# EAGLE design snarf-basecase-v00 (EAGLE 5.11)
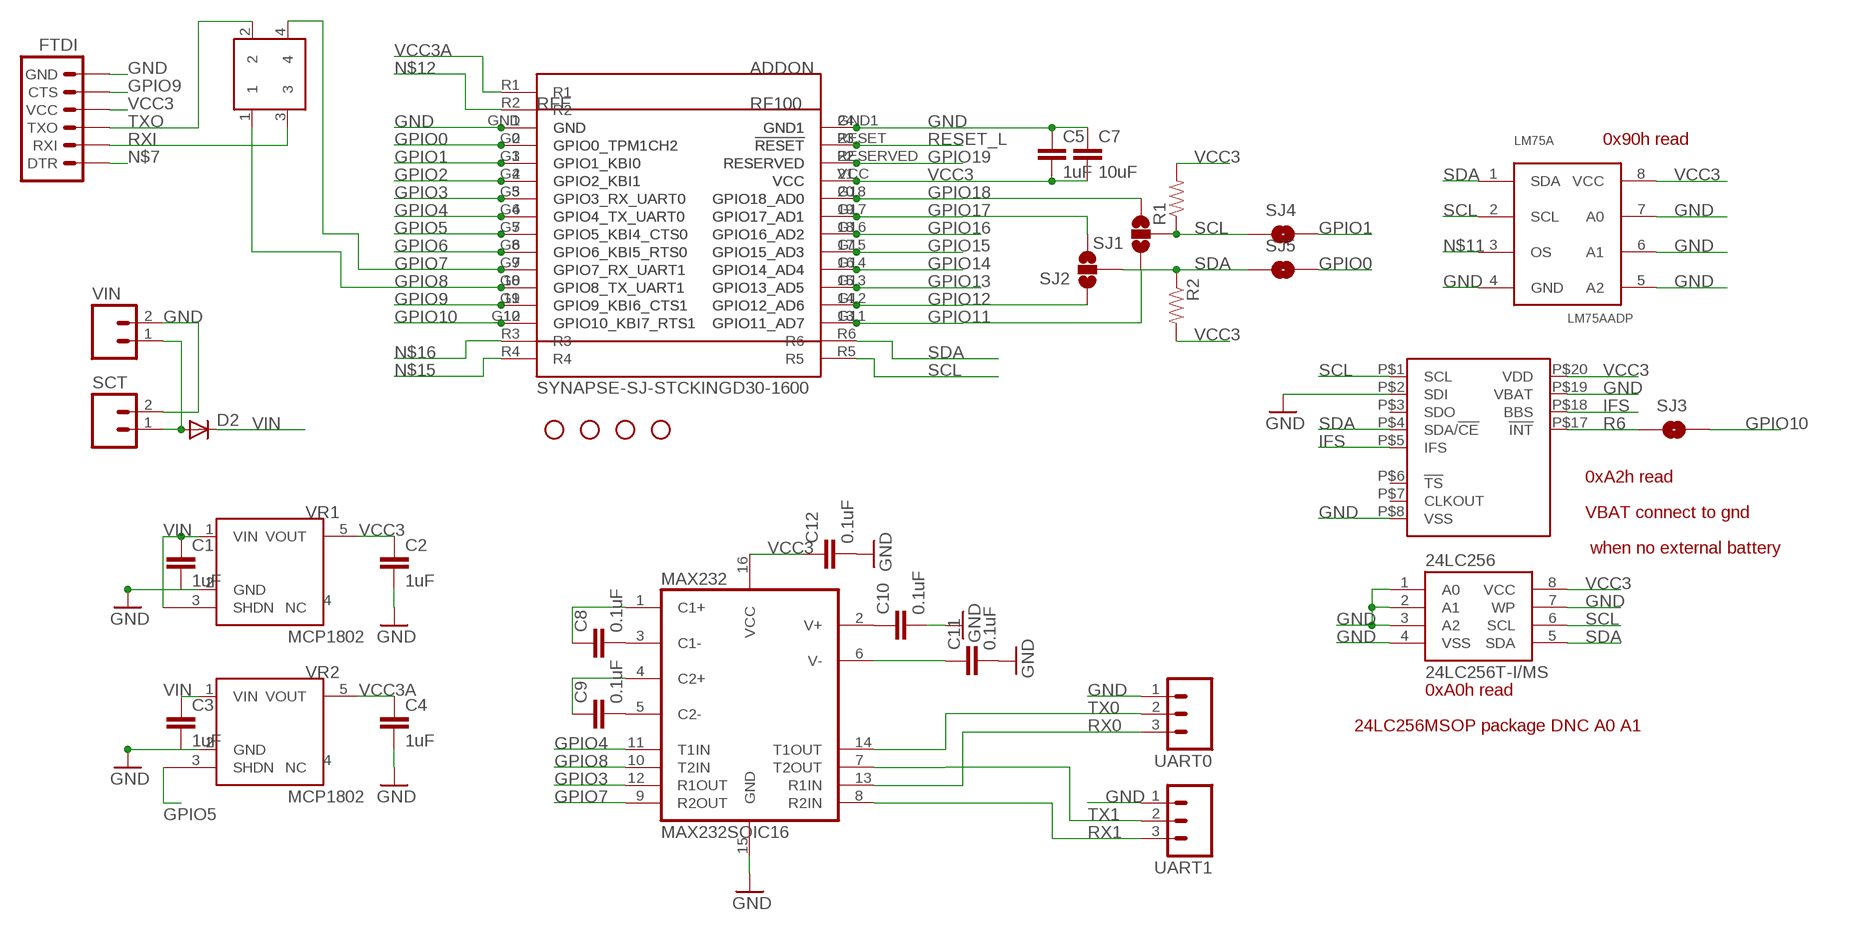
[diagram p0: schematic, sheet 1]

## Parts
24LC256  24LC256T-I/MS  EEPROM-I2CSMD  [SO08]
ADDON  SYNAPSE-SJ-STCKINGD30-1600  [SYNSJ-STACK]
C1  1uF  CAP0805  [0805]
C2  1uF  CAP0805  [0805]
C3  1uF  CAP0805  [0805]
C4  1uF  CAP0805  [0805]
C5  1uF  CAP0805  [0805]
C7  10uF  CAP0805  [0805]
C8  0.1uF  CAP0805  [0805]
C9  0.1uF  CAP0805  [0805]
C10  0.1uF  CAP0805  [0805]
C11  0.1uF  CAP0805  [0805]
C12  0.1uF  CAP0805  [0805]
D2  DIODESMA  [SMA-DIODE]
FTDI  ARDUINO_SERIAL_PROGRAMPTH  [1X06]
JP6  STAND-OFF  [STAND-OFF]
JP9  STAND-OFF  [STAND-OFF]
JP10  STAND-OFF  [STAND-OFF]
JP11  STAND-OFF  [STAND-OFF]
LM75A  LM75AADP  [TSSOP8]
MAX232  MAX232SOIC16  [SO016]
PCF2129A  PCF2129ASO20  [SO20W]
R1  RESISTOR  [0805]
R2  RESISTOR  [0805]
RFE  RFE  RF100-JACKJACK2  [SYNAPSERFENGINE-THM-SMT-JACK2]
RXTX  SERIAL_CROSSOVER  [2X02_PTH]
SCT  M023.5MM  [SCREWTERMINAL-3.5MM-2]
SJ1  SOLDERJUMPER_2WAYS  [SJ_3]
SJ2  SOLDERJUMPER_2WAYS  [SJ_3]
SJ3  SOLDERJUMPERNC2  [SJ_2S-NOTRACE]
SJ4  SOLDERJUMPERNO  [SJ_2S-NO]
SJ5  SOLDERJUMPERNO  [SJ_2S-NO]
UART0  M03PTH  [1X03]
UART1  M03PTH  [1X03]
VIN  M02PTH  [1X02]
VR1  MCP1802  [SOT23-5]
VR2  MCP1802  [SOT23-5]

## Nets
GND: 24LC256.1(A0) 24LC256.2(A1) 24LC256.3(A2) 24LC256.4(VSS) 24LC256.7(WP) ADDON.GND ADDON.GND1 C1.2 C2.2 C3.2 C4.2 C5.1 C7.1 C10.2 C11.2 C12.2 FTDI.6(GND) LM75A.4(GND) LM75A.5(A2) LM75A.6(A1) LM75A.7(A0) MAX232.15(GND) PCF2129A.P$2(SDI) PCF2129A.P$8(VSS) PCF2129A.P$19(VBAT) RFE.1(GND) RFE.24(GND1) RFE.P1 RFE.P24 RFE.P201 RFE.P224 SCT.2 UART0.1 UART1.1 VIN.2 VR1.2(GND) VR2.2(GND)
GPIO0: ADDON.G0(GPIO0_TPM1CH2) RFE.2(GPIO0_TPM1CH2) RFE.P2 RFE.P202 SJ5.2
GPIO1: ADDON.G1(GPIO1_KBI0) RFE.3(GPIO1_KBI0) RFE.P3 RFE.P203 SJ4.2
GPIO2: ADDON.G2(GPIO2_KBI1) RFE.4(GPIO2_KBI1) RFE.P4 RFE.P204
GPIO3: ADDON.G3(GPIO3_RX_UART0) MAX232.12(R1OUT) RFE.5(GPIO3_RX_UART0) RFE.P5 RFE.P205
GPIO4: ADDON.G4(GPIO4_TX_UART0) MAX232.11(T1IN) RFE.6(GPIO4_TX_UART0) RFE.P6 RFE.P206
GPIO5: ADDON.G5(GPIO5_KBI4_CTS0) RFE.7(GPIO5_KBI4_CTS0) RFE.P7 RFE.P207 VR2.3(SHDN)
GPIO6: ADDON.G6(GPIO6_KBI5_RTS0) RFE.8(GPIO6_KBI5_RTS0) RFE.P8 RFE.P208
GPIO7: ADDON.G7(GPIO7_RX_UART1) MAX232.9(R2OUT) RFE.9(GPIO7_RX_UART1) RFE.P9 RFE.P209 RXTX.4
GPIO8: ADDON.G8(GPIO8_TX_UART1) MAX232.10(T2IN) RFE.10(GPIO8_TX_UART1) RFE.P10 RFE.P210 RXTX.1
GPIO9: ADDON.G9(GPIO9_KBI6_CTS1) FTDI.5(CTS) RFE.11(GPIO9_KBI6_CTS1) RFE.P11 RFE.P211
GPIO10: ADDON.G10(GPIO10_KBI7_RTS1) RFE.12(GPIO10_KBI7_RTS1) RFE.P12 RFE.P212 SJ3.2
GPIO11: ADDON.G11(GPIO11_AD7) RFE.13(GPIO11_AD7) RFE.P13 RFE.P213 SJ1.1
GPIO12: ADDON.G12(GPIO12_AD6) RFE.14(GPIO12_AD6) RFE.P14 RFE.P214 SJ2.1
GPIO13: ADDON.G13(GPIO13_AD5) RFE.15(GPIO13_AD5) RFE.P15 RFE.P215
GPIO14: ADDON.G14(GPIO14_AD4) RFE.16(GPIO14_AD4) RFE.P16 RFE.P216
GPIO15: ADDON.G15(GPIO15_AD3) RFE.17(GPIO15_AD3) RFE.P17 RFE.P217
GPIO16: ADDON.G16(GPIO16_AD2) RFE.18(GPIO16_AD2) RFE.P18 RFE.P218
GPIO17: ADDON.G17(GPIO17_AD1) RFE.19(GPIO17_AD1) RFE.P19 RFE.P219 SJ2.3
GPIO18: ADDON.G18(GPIO18_AD0) RFE.20(GPIO18_AD0) RFE.P20 RFE.P220 SJ1.3
GPIO19: ADDON.RESERVED RFE.22(RESERVED) RFE.P22 RFE.P222
IFS: PCF2129A.P$5(IFS) PCF2129A.P$18(BBS)
N$1: C8.2 MAX232.3(C1-)
N$2: D2.A SCT.1 VIN.1
N$4: C9.2 MAX232.5(C2-)
N$5: C10.1 MAX232.2(V+)
N$6: C11.1 MAX232.6(V-)
N$7: FTDI.1(DTR)
N$8: C8.1 MAX232.1(C1+)
N$10: C9.1 MAX232.4(C2+)
N$11: LM75A.3(OS)
N$12: ADDON.R2
N$15: ADDON.R4
N$16: ADDON.R3
R6: PCF2129A.P$17(!INT) SJ3.1
RESET_L: ADDON.RESET(!RESET) RFE.23(!RESET) RFE.P23 RFE.P223
RX0: MAX232.13(R1IN) UART0.3
RX1: MAX232.8(R2IN) UART1.3
RXI: FTDI.2(RXI) RXTX.3
SCL: 24LC256.6(SCL) ADDON.R5 LM75A.2(SCL) PCF2129A.P$1(SCL) R1.1 SJ1.2 SJ4.1
SDA: 24LC256.5(SDA) ADDON.R6 LM75A.1(SDA) PCF2129A.P$4(SDA/!CE) R2.1 SJ2.2 SJ5.1
TX0: MAX232.14(T1OUT) UART0.2
TX1: MAX232.7(T2OUT) UART1.2
TXO: FTDI.3(TXO) RXTX.2
VCC3: 24LC256.8(VCC) ADDON.VCC C2.1 C5.2 C7.2 C12.1 FTDI.4(VCC) LM75A.8(VCC) MAX232.16(VCC) PCF2129A.P$20(VDD) R1.2 R2.2 RFE.21(VCC) RFE.P21 RFE.P221 VR1.5(VOUT)
VCC3A: ADDON.R1 C4.1 VR2.5(VOUT)
VIN: C1.1 C3.1 D2.C VR1.1(VIN) VR1.3(SHDN) VR2.1(VIN)
Unconnected: PCF2129A.P$3(SDO) PCF2129A.P$6(!TS) PCF2129A.P$7(CLKOUT) VR1.4(NC) VR2.4(NC)

## Notes on the sheet
- 0x90h read
- 0xA2h read
- VBAT connect to gnd
- when no external battery
- 0xA0h read
- 24LC256MSOP package DNC A0 A1

## Library data of the parts
24LC256 = SparkFun:EEPROM-I2C
ADDON = 0_jc-custom:SYNAPSE-SJ-STCKING: Standard layout for expansion modules using Synapse Wireless boards
C1-C5 C7-C12 = 0_jc-custom:CAP: Capacitor Standard 0603 ceramic capacitor, and 0.1" leaded capacitor.
D2 = SparkFun:DIODE: Diode These are standard reverse protection diodes and small signal diodes. SMA package can handle up to about 1A. SOD-323 can handle about 200mA. What the SOD-323 package when ordering, there are some mfgs out there that are 5-pin packages.
FTDI = SparkFun:ARDUINO_SERIAL_PROGRAM
JP6 JP9-JP11 = SparkFun:STAND-OFF: Stand Off This is the mechanical footprint for a #4 phillips button head screw. Use the keepout ring to avoid running the screw head into surrounding components. SKU : PRT-00447
LM75A = 0_jc-custom:LM75A
MAX232 = SparkFun:MAX232: RS232 Transceiver Very common IC. This is generically called 'MAX232', but works with the 3V equivalent MAX3232 generic ICs. Field tested and mother approved. Spark Fun Electronics SKU : COM-00316 (DIP) and COM-00589 (SMD)
PCF2129A = 0_jc-custom:PCF2129A
R1 R2 = SparkFun:RESISTOR: Resistor Basic schematic elements and footprints for 0603, 1206, and PTH 1/10th watt (small) resistors.
RFE = 0_jc-custom:RF100-JACK
RXTX = 0_jc-custom:SERIAL_CROSSOVER
SCT VIN = SparkFun:M02: Header 2 Standard 2-pin 0.1" header. Use with straight break away headers (SKU : PRT-00116), right angle break away headers (PRT-00553), swiss pins (PRT-00743), machine pins (PRT-00117), and female headers (PRT-00115). Molex polarized connector foot print use with SKU : PRT-08233 with associated crimp pins and housings.
SJ1 SJ2 = SparkFun:SOLDERJUMPER_2WAY: Solder Jumper 2 way solder jumper
SJ3-SJ5 = SparkFun:SOLDERJUMPER: Solder Jumper Standard SMD solder jumper. Used to automate production. Two varients : Normally Open and Normally Closed are the same, but have different paste layers. NC will have a large amount of paste and should jumper during reflow.
UART0 UART1 = SparkFun:M03: Header 3 Standard 3-pin 0.1" header. Use with straight break away headers (SKU : PRT-00116), right angle break away headers (PRT-00553), swiss pins (PRT-00743), machine pins (PRT-00117), and female headers (PRT-00115). Molex polarized connector foot print use with SKU : PRT-08232 with associated crimp pins and housings.
VR1 VR2 = 0_jc-custom:MCP1802

## Net classes
0 default: width 0.152 mm
1 Power: width 0.508 mm
2 smallsignal: width 0.152 mm
3 stdsignal: width 0.254 mm

## Board
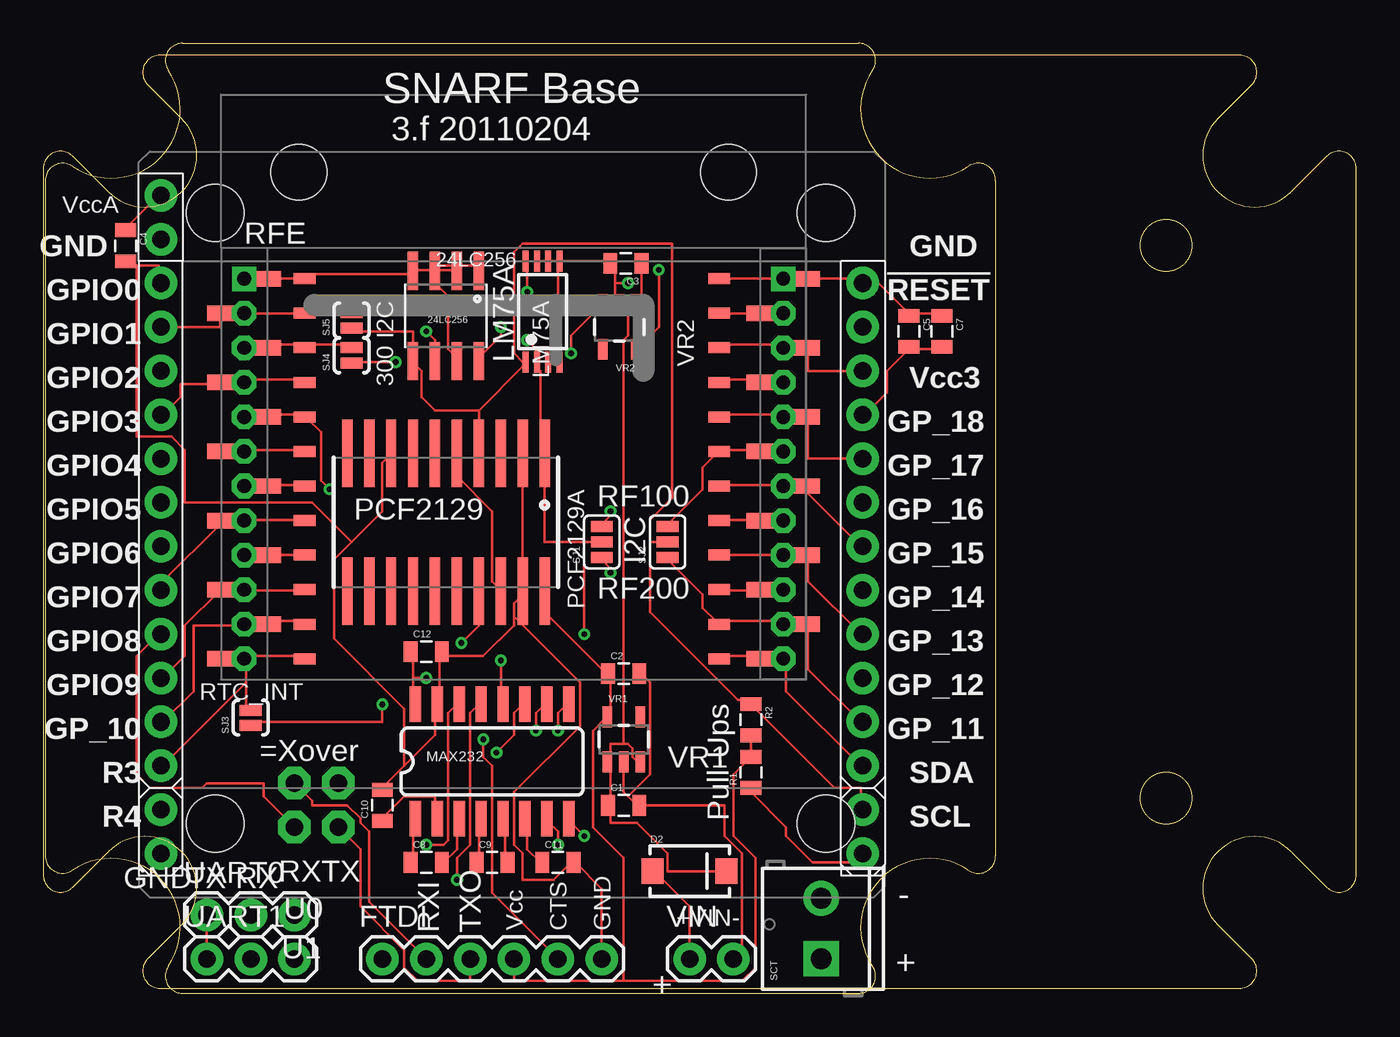
[diagram p1: board, top side]
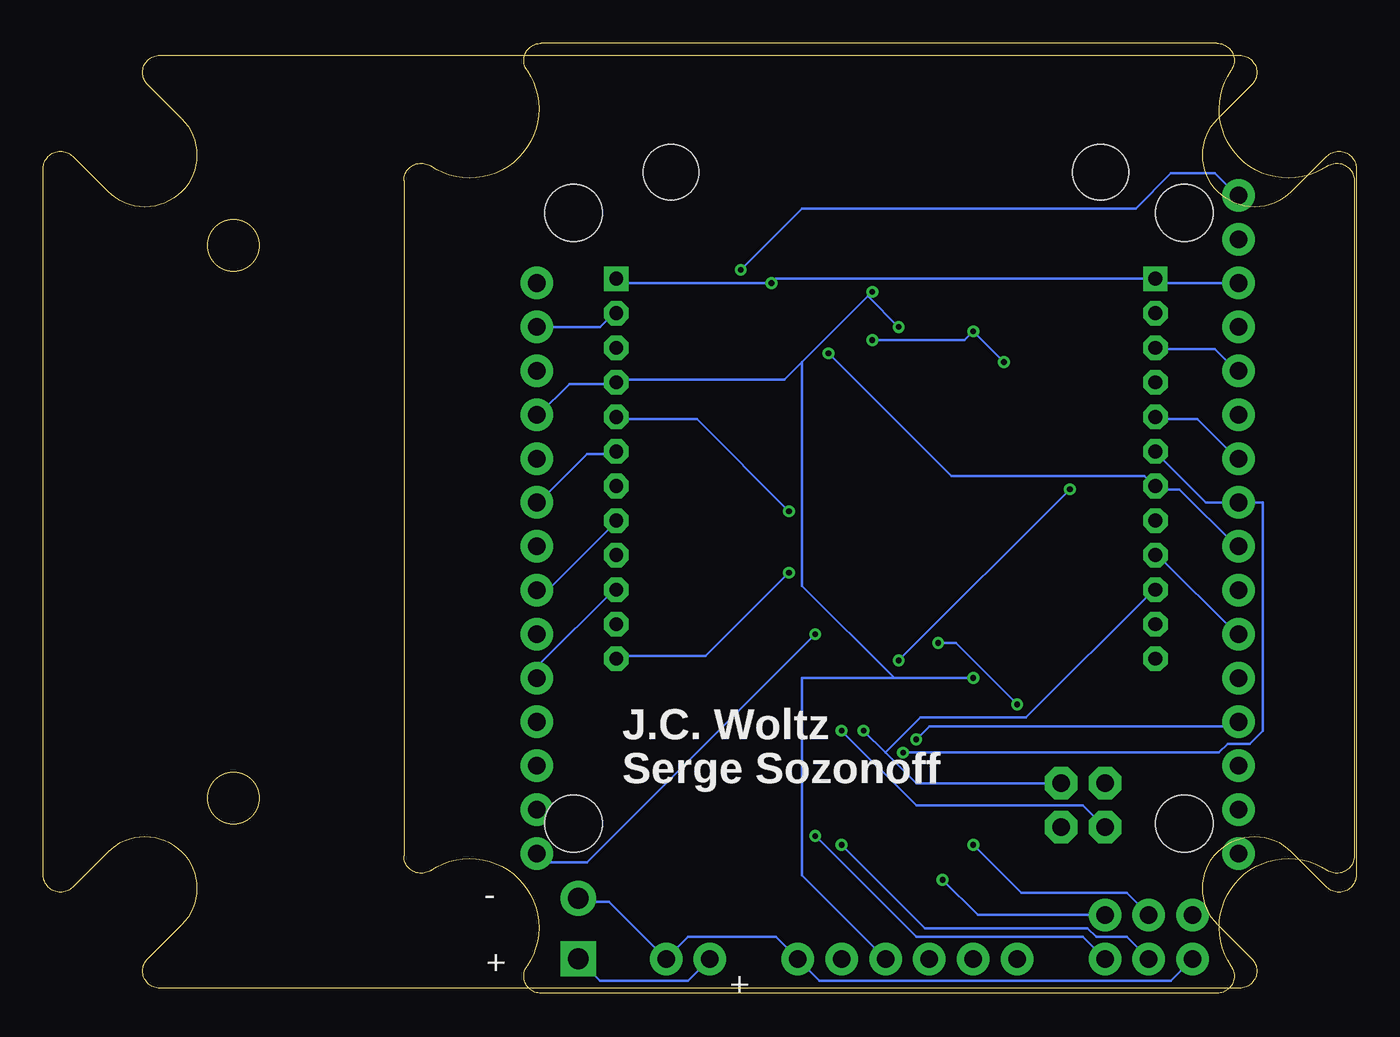
[diagram p2: board, bottom side, seen from below]

Size 76 x 55 mm. Coordinates in mm from the lower left corner, seen from the top.
Outline: 72.24,46.4 arc-180 68,50.64 69.95,52.59 arc135 69.24,54.3 6.75,54.3 arc135 6.05,52.59 8,50.64 arc-180 3.76,46.4 1.71,48.45 arc135 0,47.74 0,6.85 arc135 1.71,6.15 3.76,8.2 arc-180 8,3.96 6.05,2.01 arc135 6.75,0.3 69.24,0.3 arc135 69.95,2.01 68,3.96 arc-180 72.24,8.2 74.29,6.15 arc135 76,6.85 76,47.74 arc135 74.29,48.45 72.24,46.4
Outline: 48,53.44 arc158 53.56,47.88 arc-124 55.12,47.05 55.12,7.95 arc-124 53.56,7.12 arc158 48,1.56 arc-124 47.18,0 8.07,0 arc-124 7.24,1.56 arc158 1.69,7.12 arc-124 0.12,7.95 0.12,47.05 arc-124 1.69,47.88 arc158 7.24,53.44 arc-124 8.07,55 47.18,55 arc-124 48,53.44
Outline: circle at 64.99,43.3 radius 1.5
Outline: circle at 64.99,11.3 radius 1.5
Copper layers (1*16): Top 0.0356mm / dielectric 1.5011mm / Bottom 0.0356mm
Design rules "LaenPCBOrder-JCModified": minimum track width 6mil, minimum drill 13mil, track to track 6mil, track to pad 6mil, pad to pad 6mil, via to via 6mil, smd to smd 6mil, copper to edge 15mil, drill to drill 6mil, minimum pad ring 12mil, minimum via ring 7mil, stop-mask expansion 4mil, vias tented up to drill 25mil, thermal gap 10mil

### Footprints (pad centres in the part's own frame; a part is rotated, then mirrored left to right if it is on the bottom)
SO08 = smd 0.61 x 2.21: 1 -1.905,-2.616; 2 -0.635,-2.616; 3 0.635,-2.616; 4 1.905,-2.616; 5 1.905,2.616; 6 0.635,2.616; 7 -0.635,2.616; 8 -1.905,2.616
SYNSJ-STACK = drill 1.016 pad 1.88 round: G0 0,-7.62; G1 0,-10.16; G2 0,-12.7; G3 0,-15.24; G4 0,-17.78; G5 0,-20.32; G6 0,-22.86; G7 0,-25.4; G8 0,-27.94; G9 0,-30.48; G10 0,-33.02; G11 40.64,-33.02; G12 40.64,-30.48; G13 40.64,-27.94; G14 40.64,-25.4; G15 40.64,-22.86; G16 40.64,-20.32; G17 40.64,-17.78; G18 40.64,-15.24; GND 0,-5.08; GND1 40.64,-5.08; R1 0,0; R2 0,-2.54; R3 0,-35.56; R4 0,-38.1; R5 40.64,-38.1; R6 40.64,-35.56; RESERVED 40.64,-10.16; RESET 40.64,-7.62; VCC 40.64,-12.7
0805 = smd 0.8 x 1.2: 1 -0.9,0; 2 0.9,0
SMA-DIODE = smd 1.27 x 1.47: A -2.15,0; C 2.15,0
1X06 = drill 1.016 pad 1.88 round: 1 0,0; 2 2.54,0; 3 5.08,0; 4 7.62,0; 5 10.16,0; 6 12.7,0
STAND-OFF = hole 3.302: 0,0
TSSOP8 = smd 1.2 x 0.35: 1 -2.925,0.975; 2 -2.925,0.325; 3 -2.925,-0.325; 4 -2.925,-0.975; 5 2.925,-0.975; 6 2.925,-0.325; 7 2.925,0.325; 8 2.925,0.975
SO016 = smd 0.66 x 2.032: 1 -4.445,-3.315; 2 -3.175,-3.315; 3 -1.905,-3.315; 4 -0.635,-3.315; 5 0.635,-3.315; 6 1.905,-3.315; 7 3.175,-3.315; 8 4.445,-3.315; 9 4.445,3.315; 10 3.175,3.315; 11 1.905,3.315; 12 0.635,3.315; 13 -0.635,3.315; 14 -1.905,3.315; 15 -3.175,3.315; 16 -4.445,3.315
SO20W = smd 0.6 x 3.9: P$1 -5.715,-4; P$2 -4.445,-4; P$3 -3.175,-4; P$4 -1.905,-4; P$5 -0.635,-4; P$6 0.635,-4; P$7 1.905,-4; P$8 3.175,-4; P$9 4.445,-4; P$10 5.715,-4; P$11 5.715,4; P$12 4.445,4; P$13 3.175,4; P$14 1.905,4; P$15 0.635,4; P$16 -0.635,4; P$17 -1.905,4; P$18 -3.175,4; P$19 -4.445,4; P$20 -5.715,4
SYNAPSERFENGINE-THM-SMT-JACK2 = drill 0.8 square: 1 0,0; 24 31.2,0 | drill 0.8 pad 1.422 octagon: 2 0,-2; 3 0,-4; 4 0,-6; 5 0,-8; 6 0,-10; 7 0,-12; 8 0,-14; 9 0,-16; 10 0,-18; 11 0,-20; 12 0,-22; 13 31.2,-22; 14 31.2,-20; 15 31.2,-18; 16 31.2,-16; 17 31.2,-14; 18 31.2,-12; 19 31.2,-10; 20 31.2,-8; 21 31.2,-6; 22 31.2,-4; 23 31.2,-2 | smd 1.67 x 0.89: P1 1.3,0; P2 -1.3,-2; P3 1.3,-4; P4 -1.3,-6; P5 1.3,-8; P6 -1.3,-10; P7 1.3,-12; P8 -1.3,-14; P9 1.3,-16; P10 -1.3,-18; P11 1.3,-20; P12 -1.3,-22; P13 29.9,-22; P14 32.5,-20; P15 29.9,-18; P16 32.5,-16; P17 29.9,-14; P18 32.5,-12; P19 29.9,-10; P20 32.5,-8; P21 29.9,-6; P22 32.5,-4; P23 29.9,-2; P24 32.5,0 | smd 1.27 x 0.635: P201 3.5,0; P202 3.5,-2; P203 3.5,-4; P204 3.5,-6; P205 3.5,-8; P206 3.5,-10; P207 3.5,-12; P208 3.5,-14; P209 3.5,-16; P210 3.5,-18; P211 3.5,-20; P212 3.5,-22; P213 27.5,-22; P214 27.5,-20; P215 27.5,-18; P216 27.5,-16; P217 27.5,-14; P218 27.5,-12; P219 27.5,-10; P220 27.5,-8; P221 27.5,-6; P222 27.5,-4; P223 27.5,-2; P224 27.5,0 | hole 3.2: 3.17,6.16; 28.03,6.16
2X02_PTH = drill 1.016 pad 1.88 octagon: 1 -1.27,-1.27; 2 -1.27,1.27; 3 1.27,-1.27; 4 1.27,1.27
SCREWTERMINAL-3.5MM-2 = drill 1.2 pad 2.032 square: 1 0,0 | drill 1.2 pad 2.032 round: 2 3.5,0
SJ_3 = smd 0.635 x 1.27: 1 -0.889,0; 2 0,0; 3 0.889,0
SJ_2S-NOTRACE = smd 0.635 x 1.27: 1 -0.45,0; 2 0.4,0
SJ_2S-NO = smd 0.635 x 1.27: 1 -0.45,0; 2 0.45,0
1X03 = drill 1.016 pad 1.88 round: 1 0,0; 2 2.54,0; 3 5.08,0
1X02 = drill 1.016 pad 1.88 round: 1 0,0; 2 2.54,0
SOT23-5 = smd 0.55 x 1.2: 1 -0.95,-1.3; 2 0,-1.3; 3 0.95,-1.3; 4 0.95,1.3; 5 -0.95,1.3

### Placement (x,y rotation side)
24LC256  23.31,39.21 180 top
ADDON  6.8,46.19 0 top
C1  33.6,10.89 0 top
C2  33.6,18.51 0 top
C3  33.73,42.26 180 top
C4  4.77,43.27 270 top
C5  50.11,38.32 270 top
C7  52.01,38.32 270 top
C8  22.17,7.59 0 top
C9  25.98,7.59 0 top
C10  19.63,10.89 90 top
C11  29.79,7.59 0 top
C12  22.17,19.78 0 top
D2  37.41,7.08 0 top
FTDI  19.63,2 0 top
JP6  45.3,9.82 0 top
JP9  9.95,9.82 0 top
JP10  45.3,45.18 0 top
JP11  9.95,45.18 0 top
LM75A  28.9,39.46 90 top
MAX232  25.98,13.43 0 top
PCF2129A  23.31,27.27 180 top
R1  40.97,12.79 90 top
R2  40.97,15.84 270 top
RFE  11.63,41.37 0 top
RXTX  15.82,10.89 180 top
SCT  45.03,2 90 top
SJ1  32.33,26.13 90 top
SJ2  36.14,26.13 90 top
SJ3  12.01,15.97 90 top
SJ4  17.85,36.92 90 top
SJ5  17.85,38.95 90 top
UART0  9.47,4.54 0 top
UART1  9.47,2 0 top
VIN  37.41,2 0 top
VR1  33.6,14.7 0 top
VR2  33.35,38.57 180 top

### Tracks (layer width: path | path; a pad name or v marks a point on that pad's centre or on a via)
GND  (via drill 0.33)
  Top 0.152: 33.85,11.4 33.6,11.65 33.6,13.17 VR1.2 | 33.85,11.4 34.36,10.89 C1.2 34.62,10.89 39.44,10.89 39.44,9.11 40.46,8.09 40.46,2.51 VIN.2 | 33.85,11.4 35.12,12.67 35.12,18 34.62,18.51 C2.2 | UART1.1 UART0.1 | FTDI.6 32.33,6.06 30.81,7.59 C11.2 30.55,7.59 29.54,6.57 27.76,6.57 27.76,8.09 27.25,8.6 27.25,11.65 31.06,15.46 31.06,18 27.25,21.81 | 20.9,13.17 22.68,14.95 22.68,16.73 MAX232.15 22.93,16.98 22.93,19.52 | 20.9,13.17 19.63,11.9 C10.2 | 22.93,19.52 22.93,19.78 C12.2 22.93,19.52 | 27.25,21.81 27.25,21.3 25.47,19.52 22.93,19.52 | 27.25,21.81 27.25,22.57 27.76,23.08 PCF2129A.P$19 27.76,23.33 27.76,31.21 PCF2129A.P$2 | 17.85,26.13 16.84,25.11 16.84,20.54 20.9,16.48 20.9,13.17 | 17.85,26.13 19.63,27.91 19.63,30.7 20.14,31.21 PCF2129A.P$8 | 22.68,41.88 21.41,41.88 24LC256.4 21.41,41.62 15.31,41.62 15.31,41.37 RFE.P201 15.06,41.37 13.03,41.37 RFE.P1 12.77,41.37 11.76,41.37 RFE.1 | 22.68,41.88 24LC256.3 | 24LC256.7 23.95,36.8 23.44,37.3 23.44,40.35 22.68,41.11 22.68,41.62 24LC256.3 | 5.41,42.13 6.68,42.13 6.68,41.11 ADDON.GND | 5.41,42.13 4.9,42.13 C4.2 | 33.09,41.11 33.09,41.88 32.84,42.13 C3.2 32.58,42.38 30.04,42.38 LM75A.5 | 33.09,41.11 33.09,40.35 33.35,40.1 VR2.2 | 29.28,42.38 28.52,42.38 LM75A.7 | 29.28,42.38 LM75A.6 29.28,42.38 | 29.79,42.38 29.79,36.54 LM75A.4 | LM75A.5 29.79,42.38 | 29.79,42.38 29.28,42.38 | LM75A.5 29.79,42.38 | RFE.P224 39.19,41.37 42.74,41.37 RFE.24 43,41.37 44.01,41.37 RFE.P24 44.27,41.37 47.32,41.37 47.32,41.11 ADDON.GND1 47.57,41.11 48.33,41.11 50.11,39.34 | 50.11,39.34 51.89,39.34 C7.1 | 50.11,39.34 C5.1 50.11,39.34 | v33.85,41.11 33.09,41.11
  Top 0.152: 17.85,26.13 15.57,28.41 8.2,28.41 8.2,31.46 7.44,32.22 5.41,32.22 5.41,42.13 | 22.68,41.88 23.95,41.88 24LC256.2 | 22.68,41.88 24LC256.3 | 22.68,41.88 22.93,42.13 25.22,42.13 25.22,41.88 24LC256.1 | 22.68,41.88 24LC256.3
  Bottom 0.152: SCT.2 45.03,5.3 43.25,5.3 VIN.2 38.68,3.27 33.6,3.27 FTDI.6 31.06,0.73 10.74,0.73 UART1.1 | ADDON.GND 6.93,41.11 11.25,41.11 11.5,41.37 RFE.1 11.76,41.37 33.6,41.37 v33.85,41.11 42.49,41.11 42.74,41.37 RFE.24
GPIO0
  Top 0.152: SJ5.2 17.85,39.34 15.31,39.34 RFE.P202 15.06,39.34 11.76,39.34 RFE.2 11.5,39.34 10.49,39.34 RFE.P2 10.23,39.34 10.23,38.57 6.93,38.57 ADDON.G0
GPIO1
  Top 0.152: SJ4.2 17.85,37.56 15.31,37.56 RFE.P203 15.06,37.56 13.03,37.56 RFE.P3 12.77,37.56 11.76,37.56 RFE.3
  Bottom 0.152: ADDON.G1 6.93,36.03 8.2,37.3 11.5,37.3 RFE.3
GPIO2
  Top 0.152: RFE.P204 15.06,35.53 11.76,35.53 RFE.4 11.5,35.53 10.49,35.53 RFE.P4 10.23,35.27 7.95,35.27 7.95,34.51 6.93,33.49 ADDON.G2
GPIO3  (via drill 0.33)
  Top 0.152: v26.49,19.27 26.49,16.98 MAX232.12 | v16.58,29.18 16.07,29.68 16.07,32.48 15.31,33.24 RFE.P205 15.06,33.49 13.03,33.49 RFE.P5 12.77,33.49 11.76,33.49 RFE.5
  Bottom 0.152: v16.58,29.18 v26.49,19.27 | ADDON.G3 6.93,30.95 9.22,33.24 11.5,33.24 RFE.5
GPIO4  (via drill 0.33)
  Top 0.152: RFE.P206 15.06,31.46 11.76,31.46 RFE.6 11.5,31.46 10.49,31.46 RFE.P6 | v26.23,13.94 27.25,14.95 27.25,16.22 27.76,16.73 MAX232.11
  Bottom 0.152: v26.23,13.94 7.95,13.94 7.44,14.44 6.17,14.44 5.41,15.21 5.41,28.41 6.68,28.41 ADDON.G4 6.93,28.41 8.71,28.41 11.5,31.21 RFE.6
GPIO5  (via drill 0.33)
  Top 0.152: RFE.P207 15.06,29.43 13.03,29.43 RFE.P7 12.77,29.43 11.76,29.43 RFE.7 | v30.55,37.05 30.55,38.07 32.33,39.84 VR2.3
  Bottom 0.152: v30.55,37.05 23.44,29.94 12.26,29.94 11.76,29.43 RFE.7 11.5,29.18 10.23,29.18 6.93,25.87 ADDON.G5
GPIO6
  Top 0.152: RFE.P208 15.06,27.4 11.76,27.4 RFE.8 11.5,27.4 10.49,27.4 RFE.P8 10.23,27.14 6.93,23.84 6.93,23.33 ADDON.G6
GPIO7  (via drill 0.33)
  Top 0.152: RFE.P209 15.06,25.37 13.03,25.37 RFE.P9 12.77,25.37 11.76,25.37 RFE.9 | v29.79,15.21 29.79,16.22 30.3,16.73 MAX232.9 | RXTX.4 12.77,11.4 12.77,12.16 9.47,12.16 9.22,11.9 6.17,11.9 5.41,12.67 5.41,19.52 6.68,20.79 ADDON.G7
  Bottom 0.152: RFE.9 11.5,25.37 6.93,20.79 ADDON.G7 | v29.79,15.21 25.47,10.89 15.82,10.89 RXTX.4
GPIO8  (via drill 0.33)
  Top 0.152: RFE.P210 15.06,23.33 11.76,23.33 RFE.10 11.5,23.33 10.49,23.33 RFE.P10 10.23,23.33 8.2,21.3 8.2,19.52 6.93,18.25 ADDON.G8 | v28.52,15.21 28.52,16.22 29.03,16.73 MAX232.10
  Bottom 0.152: 27.25,13.94 25.47,12.16 RXTX.1 | 27.25,13.94 v28.52,15.21 | 27.25,13.94 25.22,15.97 19.12,15.97 11.76,23.33 RFE.10
GPIO9  (via drill 0.33)
  Top 0.152: RFE.P211 15.06,21.56 13.03,21.56 RFE.P11 12.77,21.3 11.76,21.3 RFE.11 11.5,21.3 8.71,21.3 8.71,17.49 6.93,15.71 ADDON.G9 | FTDI.5 25.98,5.81 25.98,13.17 25.47,13.68 v25.47,14.7
  Bottom 0.152: v25.47,14.7 24.71,15.46 7.18,15.46 6.93,15.71 ADDON.G9
GPIO10
  Top 0.152: 11.76,18 11.76,19.27 RFE.12 | 11.76,18 11.76,16.73 12.01,16.48 SJ3.2 | RFE.P212 15.06,19.52 11.76,19.52 RFE.12 | RFE.P12 10.49,19.52 11.5,19.52 RFE.12 | 11.76,18 6.93,13.17 ADDON.G10
GPIO11  (via drill 0.33)
  Top 0.152: RFE.P213 39.19,19.52 41.47,19.52 RFE.P13 41.73,19.52 42.74,19.52 RFE.13 43,19.27 43,17.49 47.32,13.17 ADDON.G11 | v32.84,24.35 32.84,24.6 32.33,25.11 SJ1.1
  Bottom 0.152: v32.84,24.35 37.66,19.52 42.74,19.52 RFE.13
GPIO12
  Top 0.152: SJ2.1 36.14,25.11 38.17,23.08 38.17,22.32 38.93,21.56 RFE.P214 39.19,21.56 42.74,21.56 RFE.14 43,21.3 44.01,21.3 RFE.P14 44.27,21.3 44.27,18.76 47.32,15.71 ADDON.G12
GPIO13
  Top 0.152: RFE.P215 39.19,23.33 41.47,23.33 RFE.P15 41.73,23.33 42.74,23.33 RFE.15
  Bottom 0.152: RFE.15 43,23.33 47.32,19.02 47.32,18.25 ADDON.G13
GPIO14
  Top 0.152: RFE.P216 39.19,25.37 42.74,25.37 RFE.16 43,25.37 44.01,25.37 RFE.P16 44.27,25.37 44.27,23.84 47.32,20.79 ADDON.G14
GPIO15
  Top 0.152: RFE.P217 39.19,27.4 41.47,27.4 RFE.P17 41.73,27.4 42.74,27.4 RFE.17
  Bottom 0.152: RFE.17 43,27.14 46.81,23.33 47.32,23.33 ADDON.G15
GPIO16
  Top 0.152: RFE.P218 39.19,29.43 42.74,29.43 RFE.18 43,29.43 44.01,29.43 RFE.P18 44.27,29.18 44.27,28.92 47.32,25.87 ADDON.G16
GPIO17
  Top 0.152: RFE.19 42.74,31.46 41.73,31.46 RFE.P19 41.47,31.46 39.19,31.46 RFE.P219 38.93,31.21 38.17,30.45 38.17,29.18 36.14,27.14 SJ2.3
  Bottom 0.152: ADDON.G17 47.32,28.41 44.52,31.21 43,31.21 RFE.19
GPIO18  (via drill 0.33)
  Top 0.152: v32.84,27.91 32.84,27.65 32.33,27.14 SJ1.3 | RFE.P220 39.19,33.49 42.74,33.49 RFE.20 43,33.49 44.01,33.49 RFE.P20 44.27,33.24 44.27,30.95 47.32,30.95 ADDON.G18
  Bottom 0.152: v32.84,27.91 38.17,33.24 42.74,33.24 RFE.20
GPIO19
  Top 0.152: RFE.P222 39.19,37.56 42.74,37.56 RFE.22 43,37.3 44.01,37.3 RFE.P22 44.27,37.3 44.27,36.03 47.32,36.03 ADDON.RESERVED
IFS
  Top 0.152: PCF2129A.P$18 26.49,23.33 25.98,23.84 25.98,27.91 23.95,29.94 23.95,31.21 PCF2129A.P$5
N$1
  Top 0.152: C8.2 23.19,7.59 23.95,8.35 23.95,9.87 MAX232.3
N$2
  Top 0.152: VIN.1 37.41,5.05 35.38,7.08 D2.A
  Bottom 0.152: SCT.1 43.76,0.73 38.68,0.73 VIN.1
N$4
  Top 0.152: C9.2 26.74,7.59 26.74,9.87 MAX232.5
N$5
  Top 0.152: C10.1 19.63,10.13 20.9,11.4 22.68,11.4 22.68,10.13 MAX232.2
N$6
  Top 0.152: C11.1 28.77,7.59 28.01,8.35 28.01,9.87 MAX232.6
N$8
  Top 0.152: C8.1 21.41,7.59 21.41,9.87 MAX232.1
N$10
  Top 0.152: C9.1 25.22,7.59 25.22,9.87 MAX232.4
R6  (via drill 0.33)
  Top 0.152: v19.63,16.73 19.63,15.71 12.01,15.71 SJ3.1 | v24.2,20.29 25.22,21.3 25.22,23.08 PCF2129A.P$17
  Bottom 0.152: v19.63,16.73 23.19,20.29 v24.2,20.29
RESET_L
  Top 0.152: RFE.P223 39.19,39.34 41.47,39.34 RFE.P23 41.73,39.34 42.74,39.34 RFE.23
  Bottom 0.152: RFE.23 43,39.34 43.76,38.57 47.32,38.57 ADDON.RESET
RX0  (via drill 0.33)
  Top 0.152: v23.95,6.57 23.95,7.84 24.71,8.6 24.71,16.22 25.22,16.73 MAX232.13
  Bottom 0.152: v23.95,6.57 21.92,4.54 UART0.3
RX1  (via drill 0.33)
  Top 0.152: v31.31,9.11 30.55,9.87 MAX232.8
  Bottom 0.152: v31.31,9.11 25.47,3.27 15.82,3.27 UART1.3
RXI
  Top 0.152: FTDI.2 18.87,5.3 18.87,9.36 18.36,9.87 18.36,10.13 17.6,10.89 15.57,10.89 15.57,11.14 RXTX.3
SCL  (via drill 0.33)
  Top 0.152: R1.1 40.97,11.65 43,9.62 43,9.11 44.52,7.59 47.32,7.59 47.32,8.09 ADDON.R5 | v20.39,36.54 17.85,36.54 SJ4.1 | v22.17,38.32 22.68,37.81 22.68,36.8 24LC256.6 | 31.31,26.13 29.03,26.13 29.03,31.21 PCF2129A.P$1 29.03,31.46 28.77,31.72 28.77,36.03 28.52,36.29 LM75A.2 28.52,36.54 28.52,37.3 v28.01,37.81 | 31.31,26.13 SJ1.2 | v31.31,20.79 31.31,26.13
  Bottom 0.152: v20.39,36.54 v22.17,38.32 22.68,37.81 v28.01,37.81 | v31.31,20.79 44.52,7.59 46.81,7.59 47.32,8.09 ADDON.R5
SDA
  Top 0.152: SJ5.1 17.85,38.32 21.41,38.32 21.41,36.8 24LC256.5 21.41,36.54 21.92,36.03 21.92,34.51 22.68,33.75 25.22,33.75 | 25.22,33.75 27.76,36.29 LM75A.1 27.76,36.54 27.25,37.05 27.25,42.89 27.76,43.4 36.39,43.4 36.39,28.67 35.12,27.4 35.12,26.13 | 25.22,33.75 25.22,31.46 PCF2129A.P$4 | ADDON.R6 47.32,10.63 47.32,11.9 45.79,11.9 R2.1 40.97,16.98 40.2,16.98 35.12,22.06 35.12,26.13 | 35.12,26.13 SJ2.2
TX0  (via drill 0.33)
  Top 0.152: v22.17,8.6 23.19,8.6 23.44,8.86 23.44,16.22 23.95,16.73 MAX232.14
  Bottom 0.152: v22.17,8.6 19.38,5.81 13.28,5.81 UART0.2
TX1  (via drill 0.33)
  Top 0.152: v29.79,8.6 29.79,9.36 29.28,9.87 MAX232.7
  Bottom 0.152: v29.79,8.6 24.96,3.78 15.57,3.78 15.06,3.27 13.28,3.27 UART1.2
TXO
  Top 0.152: RXTX.2 18.36,8.35 18.36,5.05 20.9,2.51 20.9,1.49 21.66,0.73 24.71,0.73 FTDI.3
VCC3  (via drill 0.33)
  Top 0.152: PCF2129A.P$20 29.03,23.08 29.03,22.06 32.58,18.51 C2.1 32.84,18.51 32.84,16.22 VR1.5 32.58,15.97 31.82,15.21 31.82,9.62 33.6,7.84 33.6,0.73 | R2.2 40.97,14.7 40.97,13.94 R1.2 40.97,13.68 39.95,12.67 39.95,9.11 41.22,7.84 41.22,1.49 40.46,0.73 33.6,0.73 | 33.6,0.73 27.25,0.73 FTDI.4 | 50.11,37.3 51.89,37.3 C7.2 | 50.11,37.3 C5.2 50.11,37.3 | 50.11,37.3 48.84,36.03 48.84,34.76 47.57,33.49 ADDON.VCC | 21.41,18.25 21.41,16.98 MAX232.16 | 21.41,18.25 21.41,19.78 C12.1 | RFE.P221 39.19,35.53 41.47,35.53 RFE.P21 41.73,35.53 42.74,35.53 RFE.21 | v28.01,40.61 28.01,42.38 LM75A.8 | v26.49,38.57 26.49,38.07 25.22,36.8 24LC256.8 | v22.17,18.25 21.41,18.25
  Bottom 0.152: 32.08,36.54 33.09,35.53 42.74,35.53 RFE.21 43,35.27 45.54,35.27 47.32,33.49 ADDON.VCC | 32.08,36.54 28.27,40.35 | 28.27,40.35 v28.01,40.61 | 28.27,40.35 v26.49,38.57 | 26.74,18.25 v22.17,18.25 | 26.74,18.25 32.08,23.59 32.08,36.54 | FTDI.4 32.08,6.82 32.08,18.25 26.74,18.25
VCC3A  (via drill 0.33)
  Top 0.152: C4.1 4.9,44.42 6.68,46.19 ADDON.R1 | v35.63,41.88 35.63,38.57 34.36,37.3 VR2.5
  Bottom 0.152: v35.63,41.88 32.08,45.43 12.77,45.43 10.74,47.46 8.2,47.46 6.93,46.19 ADDON.R1
VIN
  Top 0.152: C3.1 34.62,42.13 34.62,40.35 34.36,40.1 VR2.1 34.11,39.84 33.85,39.59 33.85,38.07 33.6,37.81 33.6,14.44 | 32.84,10.89 32.84,13.17 VR1.1 32.84,13.43 32.84,14.44 33.6,14.44 | 32.84,10.89 C1.1 32.84,10.89 | 33.6,14.44 33.85,14.44 34.11,14.19 34.11,13.68 34.36,13.43 VR1.3 | 32.84,10.89 32.84,9.87 34.36,9.87 36.14,8.09 36.14,7.08 39.44,7.08 D2.C

### Text on the board
tPlace: SNARF Base | 3.f 20110204 | VccA | GND | 24LC256 | GND | GPIO0 | LM75A | !RESET | GPIO1 | GPIO2 | VR2 | 300 I2C | Vcc3 | GPIO3 | GP_18 | GPIO4 | RF100 | GP_17 | GPIO5 | PCF2129 | GP_16 | GPIO6 | I2C | RF200 | GP_15 | GPIO7 | GP_14 | GPIO8 | GP_13 | GPIO9 | RTC_INT | GP_12 | GP_10 | GP_11 | R3 | =Xover | VR1 | SDA | R4 | Pull-Ups | SCL | GND | TX | RX | - | U0 | RXI | TXO | Vcc | CTS | GND | +VIN- | U1 | + | +
bPlace: J.C. Woltz | Serge Sozonoff | - | + | +